# Altium schematic sheet Sheet1.SchDoc
size A4; Organization: Altium Limited; Address1: L3, 12a Rodborough Rd; Address2: Frenchs Forest; Address3: NSW; Address4: Australia 2086
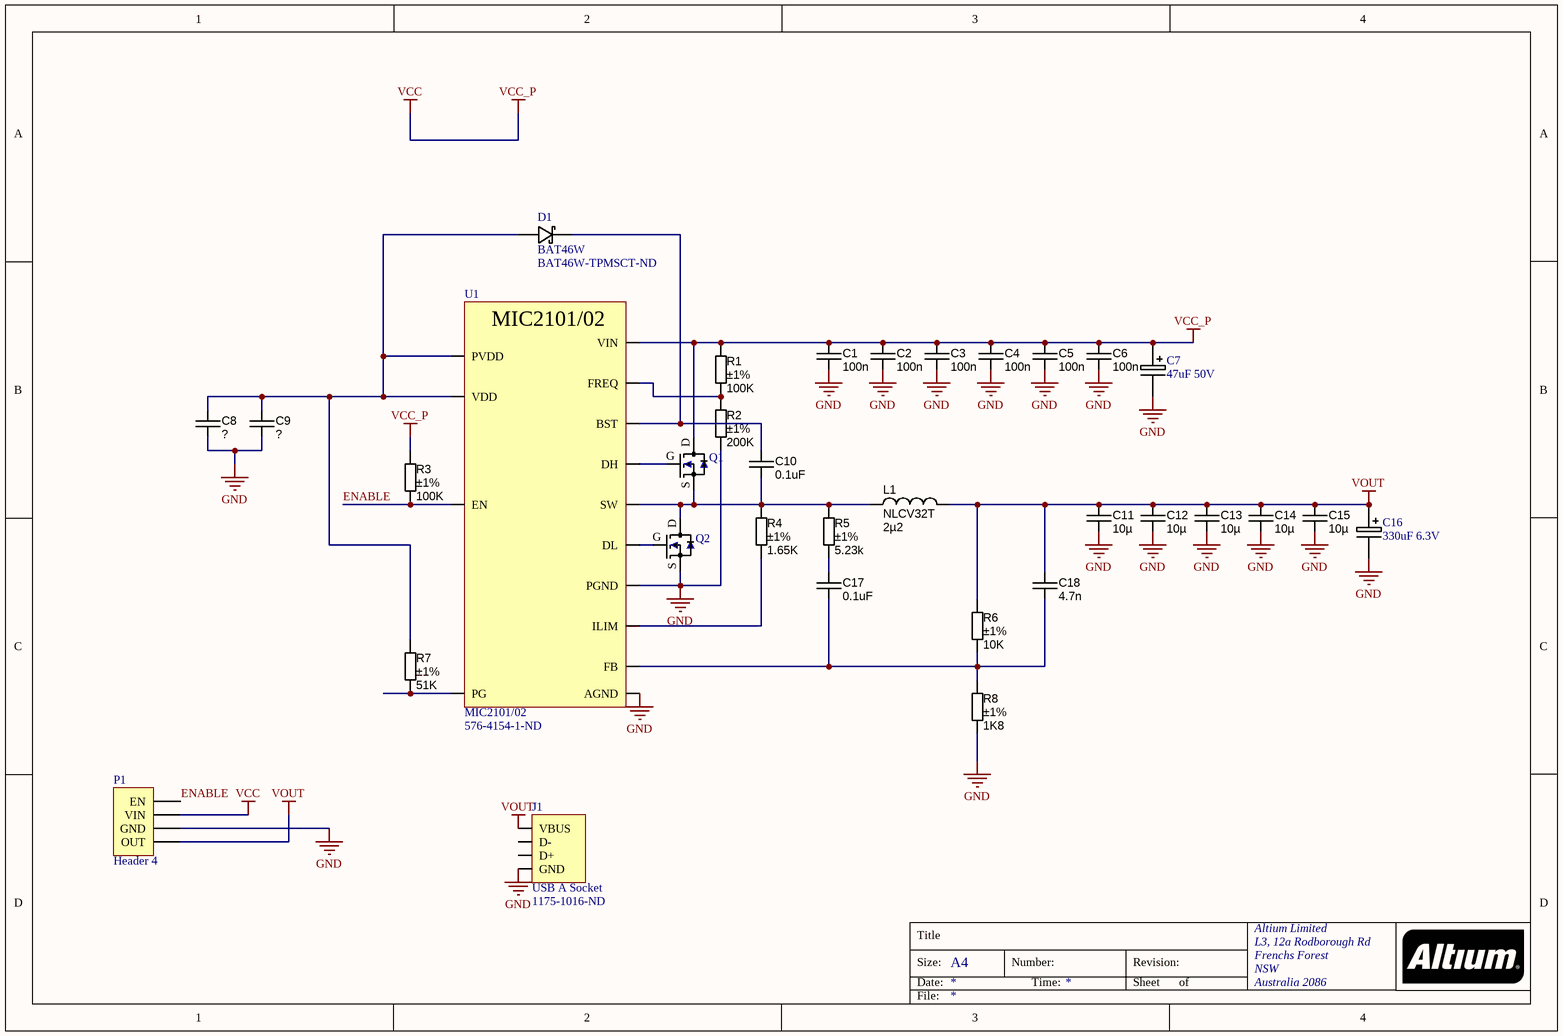
[diagram p0: Sheet1.SchDoc]

## Parts
C1  value 100n  [CAPC1608X90N]  (hidden comment: approved sub OK)
C2  value 100n  [CAPC1608X90N]  (hidden comment: approved sub OK)
C3  value 100n  [CAPC1608X90N]  (hidden comment: approved sub OK)
C4  value 100n  [CAPC1608X90N]  (hidden comment: approved sub OK)
C5  value 100n  [CAPC1608X90N]  (hidden comment: approved sub OK)
C6  value 100n  [CAPC1608X90N]  (hidden comment: approved sub OK)
C7  47uF 50V  [Capacitor Panasonic FTV-D]
C8  approved sub OK  [CAPC1608X90N]  (value not drawn)
C9  approved sub OK  [CAPC1608X90N]  (value not drawn)
C10  value 0.1uF  [CAPC1608X90N]  (hidden comment: approved sub OK)
C11  value 10µ  [CAPC2012X135N]  (hidden comment: approved sub OK)
C12  value 10µ  [CAPC2012X135N]  (hidden comment: approved sub OK)
C13  value 10µ  [CAPC2012X135N]  (hidden comment: approved sub OK)
C14  value 10µ  [CAPC2012X135N]  (hidden comment: approved sub OK)
C15  value 10µ  [CAPC2012X135N]  (hidden comment: approved sub OK)
C16  330uF 6.3V  [Capacitor Panasonic FTV-D]
C17  value 0.1uF  [CAPC1608X90N]  (hidden comment: approved sub OK)
C18  4.7n  [CAPC1608X90N]
D1  BAT46W  Supplier Part Number 1: BAT46W-TPMSCT-ND  [BAT46W]
J1  USB A Socket  Supplier Part Number 1: 1175-1016-ND  [USB A Socket - 1002-002-01100]
L1  NLCV32T  value 2µ2  [INDM3225X240N]
P1  Header 4  [HDR1X4]
Q1  MOSFET N-CH 30V 6A 4.5V Drive SSM3K333R  [SSM3K333R]  (value not drawn)
Q2  MOSFET N-CH 30V 6A 4.5V Drive SSM3K333R  [SSM3K333R]  (value not drawn)
R1  value 100K  Tolerance: ±1%  [RESC1608X55N]  (hidden comment: Thick Film)
R2  value 200K  Tolerance: ±1%  [RESC1608X55N]  (hidden comment: Thick Film)
R3  value 100K  Tolerance: ±1%  [RESC1608X55N]  (hidden comment: Thick Film)
R4  value 1.65K  Tolerance: ±1%  [RESC1608X55N]  (hidden comment: Thick Film)
R5  value 5.23k  Tolerance: ±1%  [RESC1608X55N]  (hidden comment: Thick Film)
R6  value 10K  Tolerance: ±1%  [RESC1608X55N]  (hidden comment: Thick Film)
R7  value 51K  Tolerance: ±1%  [RESC1608X55N]  (hidden comment: Thick Film)
R8  value 1K8  Tolerance: ±1%  [RESC2012X70N]  (hidden comment: Thick Film)
U1  MIC2101/02  Supplier Part Number 1: 576-4154-1-ND  [QFN50P300X300X90_HS-17N]

## Nets
GND: C1.2 C2.2 C3.2 C4.2 C5.2 C6.2 C7.- C8.2 C9.2 C11.2 C12.2 C13.2 C14.2 C15.2 C16.- J1.4(GND) P1.3(GND) Q2.S R2.2 R8.2 U1.5(PGND) U1.12(AGND)
VCC: C1.1 C2.1 C3.1 C4.1 C5.1 C6.1 C7.+ P1.2(VIN) Q1.D R1.1 R3.1 U1.16(VIN)  [also labelled VCC_P]
VOUT: C11.1 C12.1 C13.1 C14.1 C15.1 C16.+ C18.1 J1.1(VBUS) L1.2 P1.4(OUT) R6.1
ENABLE: P1.1(EN) R3.2 U1.15(EN)
NetC8_1: C8.1 C9.1 D1.A R7.1 U1.1(VDD) U1.2(PVDD)
NetC10_1: C10.1 D1.K U1.10(BST)
NetC10_2: C10.2 L1.1 Q1.S Q2.D R4.1 R5.1 U1.8(SW)
NetC17_1: C17.1 R5.2
NetC17_2: C17.2 C18.2 R6.2 R8.1 U1.13(FB)
NetQ1_G: Q1.G U1.7(DH)
NetQ2_G: Q2.G U1.4(DL)
NetR1_2: R1.2 R2.1 U1.6(FREQ)
NetR4_2: R4.2 U1.3(ILIM)
NetR7_2: R7.2 U1.14(PG)

Not connected (* = marked no-connect by the designer): J1 2(D-) 3(D+)

## Notes on the sheet
- Title
- Size:
- Date:
- A4
- Number:
- Time:
- Revision:
- Sheet
- of
- File:

## Library data of the parts
C1-C6 = CAPC_100n_0603_X7R_50V_10%: Capacitor SMD Cer 100nF 10% 50V X7R 0603; Manufacturer 1: AVX Corporation; Manufacturer Part Number 1: 06035C104KAT2A; Ratings: 50V; X7R; Material: ceramic; SCDType: spec; Manufacturer 2: TDK Corporation; Manufacturer Part Number 2: C1608X7R1H104K; Package / Case: 0603 (1608 Metric); Tolerance: ±10%; Supplier 1: Digi-Key; Supplier Part Number 1: 478-5052-1-ND; ComponentLink1URL: http://www.avx.com/docs/Catalogs/cx7r.pdf; ComponentLink1Description: http://www.avx.com/docs/Catalogs/cx7r.pdf; Supplier 2: Digi-Key; Supplier Part Number 2: 445-1314-1-ND; ComponentLink2URL: http://product.tdk.com/capacitor/mlcc/en/documents/mlcc_commercial_general_en.pdf; ComponentLink2Description: http://product.tdk.com/capacitor/mlcc/en/documents/mlcc_commercial_general_en.pdf
C7 = CAPE 47uF 50V: Supplier 1: Digi-Key; Supplier Part Number 1: PCE5023TR-ND
C8-C10 C17 = CAPC_1n_0603_X7R_100V_10%: Capacitor SMD Cer 1nF 10% 100V X7R 0603; Manufacturer 1: Murata Electronics North America; Manufacturer Part Number 1: GCM188R72A102KA37D; Ratings: 100V; X7R; Material: ceramic; SCDType: spec; Package / Case: 0603 (1608 metric); Tolerance: ±10%; Supplier 1: Digi-Key; Supplier Part Number 1: 490-4780-1-ND; Operating Temperature: -55°C ~ 125°C; Size / Dimension: 0.063" L x 0.031" W (1.60mm x 0.80mm); Thickness (Max): 0.035" (0.90mm); ComponentLink1URL: http://search.murata.co.jp/Ceramy/image/img/PDF/ENG/GCM188R72A102KA37.pdf; ComponentLink1Description: http://search.murata.co.jp/Ceramy/image/img/PDF/ENG/GCM188R72A102KA37.pdf
  C8 C9: Value: ?
C11-C15 = CAPC_10u_0805_10V: Capacitor SMD Cer 10uF 10% 10V X5R 0805; Manufacturer 1: AVX Corporation; Manufacturer Part Number 1: 0805ZD106KAT2A; Ratings: 10V; X5R; Material: ceramic; SCDType: spec; Package / Case: 0805 (2012 metric); Tolerance: ±10%; Manufacturer 2: Kemet; Manufacturer Part Number 2: C0805C106K8PACTU; Supplier 1: Digi-Key; Supplier Part Number 1: 478-5167-1-ND; ComponentLink1URL: http://www.avx.com/docs/Catalogs/cx5r.pdf; ComponentLink1Description: http://www.avx.com/docs/Catalogs/cx5r.pdf; ComponentLink2URL: http://www.kemet.com/datasheets&C0805C106K8PACTU; ComponentLink2Description: http://www.kemet.com/datasheets&C0805C106K8PACTU; Supplier 2: Digi-Key; Supplier Part Number 2: 399-4925-1-ND
C16 = CAPE 330uF 6.3V UUD0J221MCL1GS_1: Supplier 1: Digi-Key; Supplier Part Number 1: P15080TR-ND
C18 = CAPC_47n_0603_X7R_50V_10%: Capacitor SMD Cer 47nF 10% 50V X7R 0603; Manufacturer 1: AVX Corporation; Manufacturer Part Number 1: 06035C473KAT2A; Ratings: 50V; X7R; Material: ceramic; SCDType: spec; Manufacturer 3: Samsung; Manufacturer Part Number 3: CL10B473KBN; Package / Case: 0603 (1608 metric); Tolerance: ±10%; Supplier 1: Digi-Key; Supplier Part Number 1: 478-5146-1-ND; Manufacturer Part Number 2: C1608X7R1H473K080AA; Manufacturer 2: TDK Corporation; ComponentLink1URL: http://www.avx.com/docs/Catalogs/cx7r.pdf; ComponentLink1Description: http://www.avx.com/docs/Catalogs/cx7r.pdf; Supplier 2: Digi-Key; Supplier Part Number 2: 445-1313-1-ND; ComponentLink2URL: http://product.tdk.com/capacitor/mlcc/en/documents/mlcc_commercial_general_en.pdf; ComponentLink2Description: http://product.tdk.com/capacitor/mlcc/en/documents/mlcc_commercial_general_en.pdf; Value: 4.7n
L1 = INDC_2u2_1210_1200mA: Inductor 2.2uH 1.2A 1210 SMD chip; Manufacturer 1: TDK Corporation; Manufacturer Part Number 1: NLCV32T-2R2M-PFR; Ratings: 1.2 Adc; Tolerance: ±20%; Type: Ferrite Core; DC Resistance (DCR): 115 mOhm; Q @ Freq: 15 @ 7.96MHz; Frequency - Self Resonant: 68MHz; Frequency - Test: 7.96MHz; SCDType: source; Package / Case: 1210 (3225 Metric); Supplier 1: Digi-Key; Supplier Part Number 1: 445-3650-1-ND; ComponentLink1URL: http://www.tdk.co.jp/tefe02/e511_nlcv_nlc.pdf; ComponentLink1Description: http://www.tdk.co.jp/tefe02/e511_nlcv_nlc.pdf; Operating Temperature: -40°C ~ 125°C
P1 = Header 4: Header, 4-Pin; LatestRevisionDate: 17-Jul-2002; LatestRevisionNote: Re-released for DXP Platform.; Publisher: Altium Limited
R1-R5 = RES_100K_0603_1%: Resistor SMD chip 100k Ohm 0.1W 1% 0603; Manufacturer 1: Vishay/Dale; Manufacturer Part Number 1: CRCW0603100KFKEA; Ratings: 1/10W; SCDType: spec; Package / Case: 0603 (2012 metric); Supplier 1: Digi-Key; Supplier Part Number 1: 541-100KHCT-ND
R6 = RES_10K_0603_1%: Resistor SMD chip 10k Ohm 0.1W 1% 0603; Manufacturer 1: Yageo; Manufacturer Part Number 1: RC0603FR-0710KL; Ratings: 1/10W; SCDType: spec; Package / Case: 0603 (1608 Metric); Supplier 1: Digi-Key; Supplier Part Number 1: 311-10.0KHRCT-ND
R7 = RES_51K_0603_1%: Resistor SMD chip 51k Ohm 0.1W 1% 0603; Manufacturer 1: Yageo; Manufacturer Part Number 1: RC0603FR-0751KL; Ratings: 1/10W; SCDType: spec; Package / Case: 0603 (1608 Metric); Supplier 1: Digi-Key; Supplier Part Number 1: 311-51.0KHRCT-ND
R8 = RES_1K8_0805_1%: Resistor SMD chip 1.8k Ohm 0.125W 1% 0805; Manufacturer 1: Vishay/Dale; Manufacturer Part Number 1: CRCW08051K80FKEA; Ratings: 1/8W; SCDType: spec; Package / Case: 0805 (2012 metric); Supplier 1: Digi-Key; Supplier Part Number 1: 541-1.80KCCT-ND
D1 = BAT46W: Supplier 1: Digi-Key
J1 = USB A Socket: Supplier 1: Digi-Key
Q1 Q2 = MOSFET N-CH 30V 6A 4.5V Drive SSM3K333R: Supplier 1: Digi-Key; Supplier Part Number 1: SSM3K333RLFCT-ND
U1 = MIC2101/02: Supplier 1: Digi-Key